# EAGLE design Communication Board Rev A (EAGLE 9.1.2)
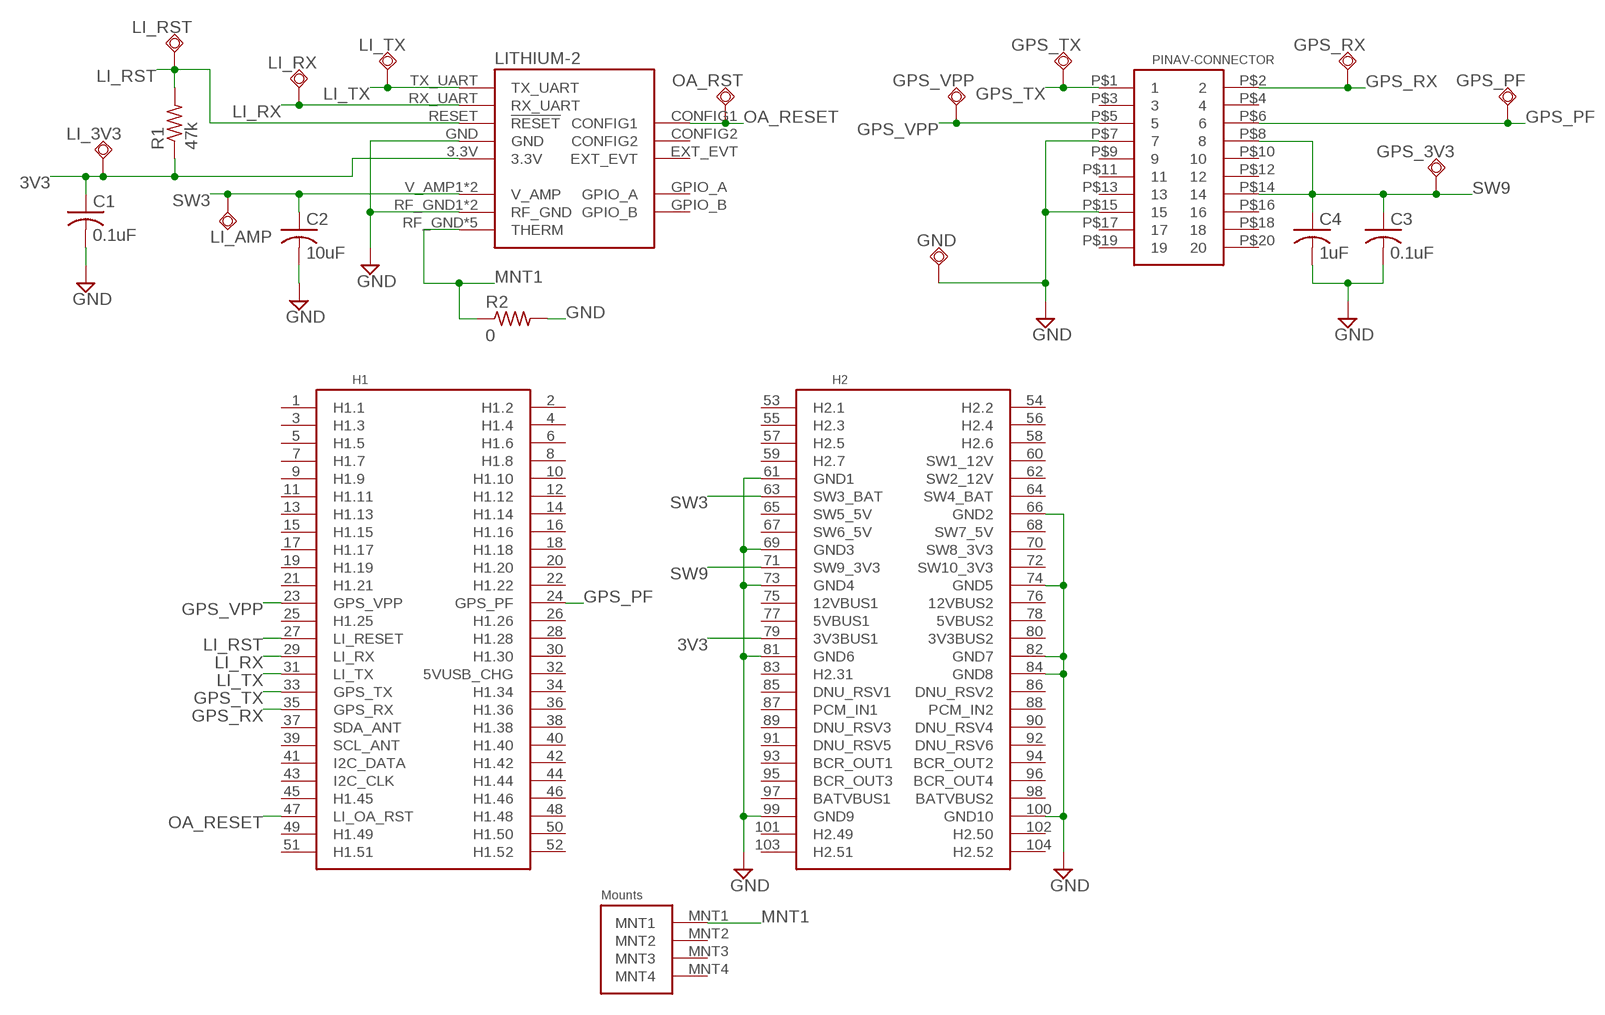
[diagram p0: schematic, sheet 1]

## Parts
C1  0.1uF  C-USC0805  [C0805]
C2  10uF  C-USC0805  [C0805]
C3  0.1uF  C-USC0805  [C0805]
C4  1uF  C-USC0805  [C0805]
GND  TPSQTP10SQ  [TP10SQ]
GPS_3V3  TPSQTP10SQ  [TP10SQ]
GPS_PF  TPSQTP10SQ  [TP10SQ]
GPS_RX  TPSQTP10SQ  [TP10SQ]
GPS_TX  TPSQTP10SQ  [TP10SQ]
GPS_VPP  TPSQTP10SQ  [TP10SQ]
LI_3V3  TPSQTP10SQ  [TP10SQ]
LI_AMP  TPSQTP10SQ  [TP10SQ]
LI_RST  TPSQTP10SQ  [TP10SQ]
LI_RX  TPSQTP10SQ  [TP10SQ]
LI_TX  TPSQTP10SQ  [TP10SQ]
LITHIUM-2  LI-2  [LI-2]
OA_RST  TPSQTP10SQ  [TP10SQ]
PINAV-CONNECTOR  HLE-110-02-X-DVHLE-110-X-DV-PE-BA  [HLE-110-02-X-DV-PE-BE]
R1  47k  R-US_R0805  [R0805]
R2  0  R-US_R0805  [R0805]
U$1  PC104_NO_DIMENSION  [PC104_NO_DIMENSION]

## Nets
3V3: C1.1 LI_3V3.TP LITHIUM-2.3.3V R1.1 U$1.79(3V3BUS1)
GND: C1.2 C2.2 C3.2 C4.2 GND.TP LITHIUM-2.GND LITHIUM-2.RF_GND1(RF_GND) LITHIUM-2.RF_GND2(RF_GND) PINAV-CONNECTOR.P$7 PINAV-CONNECTOR.P$15 R2.2 U$1.61(GND1) U$1.66(GND2) U$1.69(GND3) U$1.73(GND4) U$1.74(GND5) U$1.81(GND6) U$1.82(GND7) U$1.84(GND8) U$1.99(GND9) U$1.100(GND10)
GPS_PF: GPS_PF.TP PINAV-CONNECTOR.P$6 U$1.24(GPS_PF)
GPS_RX: GPS_RX.TP PINAV-CONNECTOR.P$2 U$1.35(GPS_RX)
GPS_TX: GPS_TX.TP PINAV-CONNECTOR.P$1 U$1.33(GPS_TX)
GPS_VPP: GPS_VPP.TP PINAV-CONNECTOR.P$5 U$1.23(GPS_VPP)
LI_RST: LI_RST.TP LITHIUM-2.RESET(!RESET) R1.2 U$1.27(LI_RESET)
LI_RX: LI_RX.TP LITHIUM-2.RX_UART U$1.29(LI_RX)
LI_TX: LI_TX.TP LITHIUM-2.TX_UART U$1.31(LI_TX)
MNT1: LITHIUM-2.RF_GND(THERM) LITHIUM-2.THERM1(THERM) LITHIUM-2.THERM2(THERM) LITHIUM-2.THERM3(THERM) LITHIUM-2.THERM4(THERM) R2.1 U$1.MNT1
OA_RESET: LITHIUM-2.CONFIG1 OA_RST.TP U$1.47(LI_OA_RST)
SW3: C2.1 LI_AMP.TP LITHIUM-2.V_AMP1(V_AMP) LITHIUM-2.V_AMP2(V_AMP) U$1.63(SW3_BAT)
SW9: C3.1 C4.1 GPS_3V3.TP PINAV-CONNECTOR.P$8 PINAV-CONNECTOR.P$14 U$1.71(SW9_3V3)
Unconnected: LITHIUM-2.CONFIG2 LITHIUM-2.EXT_EVT LITHIUM-2.GPIO_A LITHIUM-2.GPIO_B PINAV-CONNECTOR.P$3 PINAV-CONNECTOR.P$4 PINAV-CONNECTOR.P$9 PINAV-CONNECTOR.P$10 PINAV-CONNECTOR.P$11 PINAV-CONNECTOR.P$12 PINAV-CONNECTOR.P$13 PINAV-CONNECTOR.P$16 PINAV-CONNECTOR.P$17 PINAV-CONNECTOR.P$18 PINAV-CONNECTOR.P$19 PINAV-CONNECTOR.P$20 U$1.1(H1.1) U$1.2(H1.2) U$1.3(H1.3) U$1.4(H1.4) U$1.5(H1.5) U$1.6(H1.6) U$1.7(H1.7) U$1.8(H1.8) U$1.9(H1.9) U$1.10(H1.10) U$1.11(H1.11) U$1.12(H1.12) U$1.13(H1.13) U$1.14(H1.14) U$1.15(H1.15) U$1.16(H1.16) U$1.17(H1.17) U$1.18(H1.18) U$1.19(H1.19) U$1.20(H1.20) U$1.21(H1.21) U$1.22(H1.22) U$1.25(H1.25) U$1.26(H1.26) U$1.28(H1.28) U$1.30(H1.30) U$1.32(5VUSB_CHG) U$1.34(H1.34) U$1.36(H1.36) U$1.37(SDA_ANT) U$1.38(H1.38) U$1.39(SCL_ANT) U$1.40(H1.40) U$1.41(I2C_DATA) U$1.42(H1.42) U$1.43(I2C_CLK) U$1.44(H1.44) U$1.45(H1.45) U$1.46(H1.46) U$1.48(H1.48) U$1.49(H1.49) U$1.50(H1.50) U$1.51(H1.51) U$1.52(H1.52) U$1.53(H2.1) U$1.54(H2.2) U$1.55(H2.3) U$1.56(H2.4) U$1.57(H2.5) U$1.58(H2.6) U$1.59(H2.7) U$1.60(SW1_12V) U$1.62(SW2_12V) U$1.64(SW4_BAT) U$1.65(SW5_5V) U$1.67(SW6_5V) U$1.68(SW7_5V) U$1.70(SW8_3V3) U$1.72(SW10_3V3) U$1.75(12VBUS1) U$1.76(12VBUS2) U$1.77(5VBUS1) U$1.78(5VBUS2) U$1.80(3V3BUS2) U$1.83(H2.31) U$1.85(DNU_RSV1) U$1.86(DNU_RSV2) U$1.87(PCM_IN1) U$1.88(PCM_IN2) U$1.89(DNU_RSV3) U$1.90(DNU_RSV4) U$1.91(DNU_RSV5) U$1.92(DNU_RSV6) U$1.93(BCR_OUT1) U$1.94(BCR_OUT2) U$1.95(BCR_OUT3) U$1.96(BCR_OUT4) U$1.97(BATVBUS1) U$1.98(BATVBUS2) U$1.101(H2.49) U$1.102(H2.50) U$1.103(H2.51) U$1.104(H2.52) U$1.MNT2 U$1.MNT3 U$1.MNT4

## Library data of the parts
C1-C4 = resistor:C-US: CAPACITOR, American symbol
GND GPS_3V3 GPS_PF GPS_RX GPS_TX GPS_VPP LI_3V3 LI_AMP LI_RST LI_RX LI_TX OA_RST = testpad:TPSQ: Test pad
LITHIUM-2 = Cubesat:LI-2
PINAV-CONNECTOR = HLE-110-02-X-DV:HLE-110-02-X-DV
R1 R2 = resistor:R-US_: RESISTOR, American symbol
U$1 = Cubesat:PC104_NO_DIMENSION

## Board
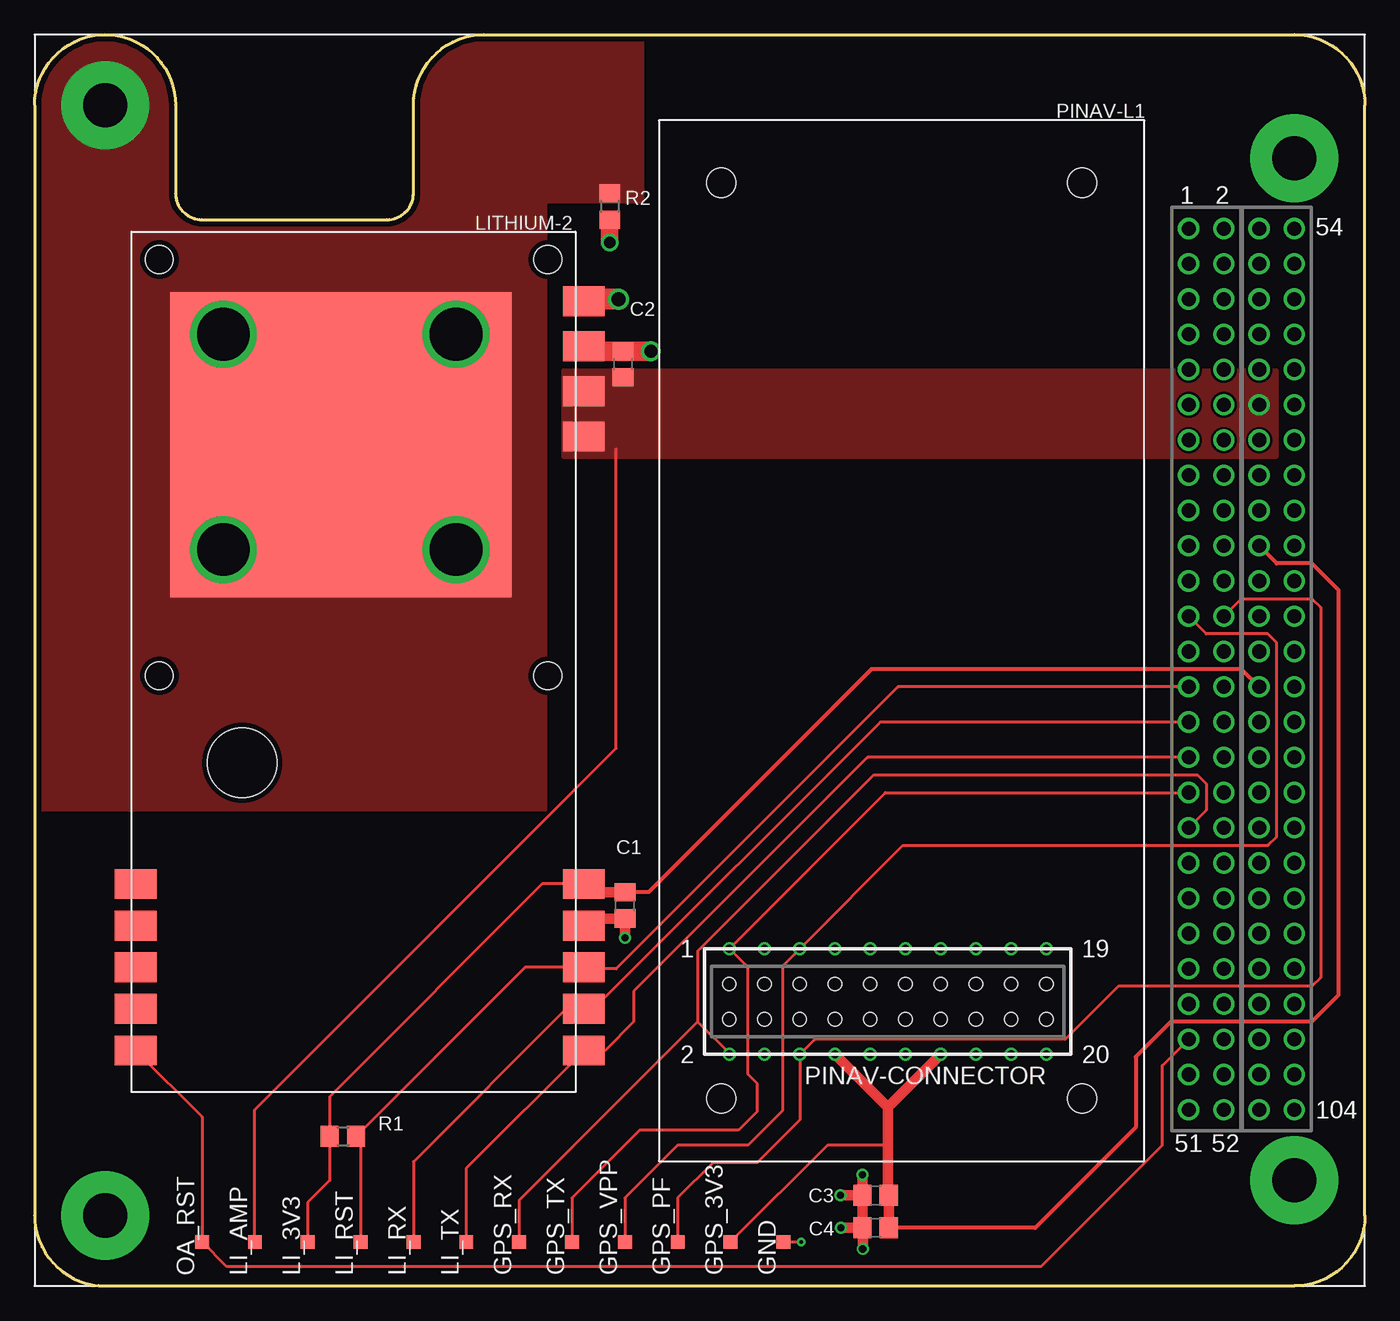
[diagram p1: board, top side]
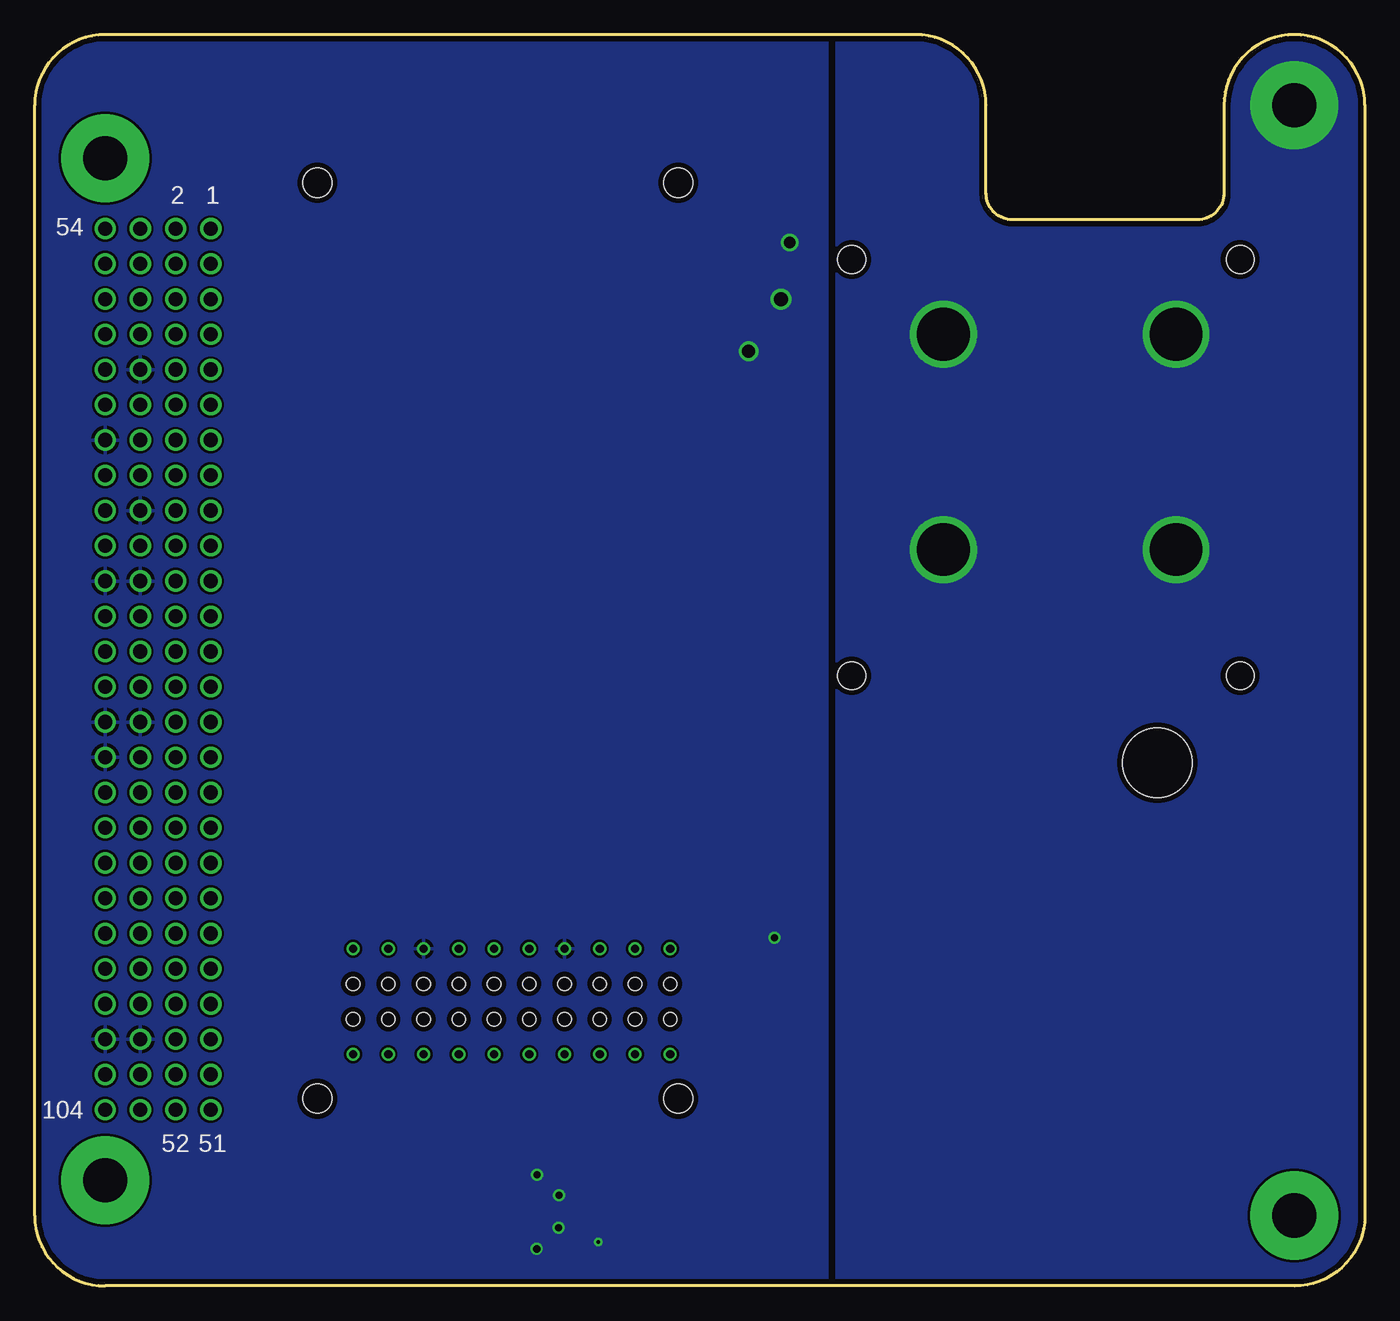
[diagram p2: board, bottom side, seen from below]

Size 95.89 x 90.17 mm. Coordinates in mm from the lower left corner, seen from the top.
Outline: 0,85.09 arc-90 5.08,90.17 arc-90 10.16,85.09 10.16,78.74 arc90 12.06,76.83 25.4,76.83 arc90 27.3,78.74 27.3,85.09 arc-90 32.38,90.17 90.81,90.17 arc-90 95.89,85.09 95.89,5.08 arc-90 90.81,0 5.08,0 arc-90 0,5.08 0,85.09
Copper layers (1*16): Top 0.035559375mm / dielectric 1.501140625mm / Bottom 0.035559375mm
Design rules "typical_4pcb": minimum track width 7mil, minimum drill 5mil, track to track 7mil, track to pad 7mil, pad to pad 7mil, via to via 7mil, smd to smd 7mil, copper to edge 15mil, drill to drill 8mil, minimum pad ring 7mil, minimum via ring 7mil, stop-mask expansion 4mil, vias tented up to drill 0mil, thermal gap 10mil

### Footprints (pad centres in the part's own frame; a part is rotated, then mirrored left to right if it is on the bottom)
C0805 = smd 1.3 x 1.5: 1 -0.95,0; 2 0.95,0
TP10SQ = smd 1 x 1: TP 0,0
LI-2 = smd 3 x 2.15: 3.3V 32.6,15; CONFIG1 0.3,3; CONFIG2 0.3,6; EXT_EVT 0.3,9; GND 32.6,12; GPIO_A 0.3,12; GPIO_B 0.3,15; RESET 32.6,9; RF_GND1 32.6,53.75; RF_GND2 32.6,57; RX_UART 32.6,6; TX_UART 32.6,3; V_AMP1 32.6,47.25; V_AMP2 32.6,50.5 | smd 24.6 x 21.98: RF_GND 15.08,46.66 | drill 3.81: THERM1 6.62,54.61; THERM2 23.4,54.61; THERM3 23.4,39.1; THERM4 6.62,39.1 | hole 2: 2,60; 2,30; 30,60; 30,30 | hole 5: 7.97,23.73
HLE-110-02-X-DV-PE-BE = drill 0.584: P$1 11.43,-3.81; P$2 11.43,3.81; P$3 8.89,-3.81; P$4 8.89,3.81; P$5 6.35,-3.81; P$6 6.35,3.81; P$7 3.81,-3.81; P$8 3.81,3.81; P$9 1.27,-3.81; P$10 1.27,3.81; P$11 -1.27,-3.81; P$12 -1.27,3.81; P$13 -3.81,-3.81; P$14 -3.81,3.81; P$15 -6.35,-3.81; P$16 -6.35,3.81; P$17 -8.89,-3.81; P$18 -8.89,3.81; P$19 -11.43,-3.81; P$20 -11.43,3.81
PINAV-L1 = hole 2.1: 30.5,4.5; 30.5,70.5; 4.5,4.5; 4.5,70.5 | hole 0.965: 7.07,64.77; 9.61,64.77; 12.15,64.77; 14.69,64.77; 17.23,64.77; 19.77,64.77; 22.31,64.77; 24.85,64.77; 27.39,64.77; 29.93,64.77; 29.93,62.23; 27.39,62.23; 24.85,62.23; 22.31,62.23; 19.77,62.23; 17.23,62.23; 14.69,62.23; 12.15,62.23; 9.61,62.23; 7.07,62.23
R0805 = smd 1.3 x 1.5: 1 -0.95,0; 2 0.95,0
PC104_NO_DIMENSION = drill 1.016 pad 1.524: 1 83.185,76.2; 2 85.725,76.2; 3 83.185,73.66; 4 85.725,73.66; 5 83.185,71.12; 6 85.725,71.12; 7 83.185,68.58; 8 85.725,68.58; 9 83.185,66.04; 10 85.725,66.04; 11 83.185,63.5; 12 85.725,63.5; 13 83.185,60.96; 14 85.725,60.96; 15 83.185,58.42; 16 85.725,58.42; 17 83.185,55.88; 18 85.725,55.88; 19 83.185,53.34; 20 85.725,53.34; 21 83.185,50.8; 22 85.725,50.8; 23 83.185,48.26; 24 85.725,48.26; 25 83.185,45.72; 26 85.725,45.72; 27 83.185,43.18; 28 85.725,43.18; 29 83.185,40.64; 30 85.725,40.64; 31 83.185,38.1; 32 85.725,38.1; 33 83.185,35.56; 34 85.725,35.56; 35 83.185,33.02; 36 85.725,33.02; 37 83.185,30.48; 38 85.725,30.48; 39 83.185,27.94; 40 85.725,27.94; 41 83.185,25.4; 42 85.725,25.4; 43 83.185,22.86; 44 85.725,22.86; 45 83.185,20.32; 46 85.725,20.32; 47 83.185,17.78; 48 85.725,17.78; 49 83.185,15.24; 50 85.725,15.24; 51 83.185,12.7; 52 85.725,12.7; 53 88.265,76.2; 54 90.805,76.2; 55 88.265,73.66; 56 90.805,73.66; 57 88.265,71.12; 58 90.805,71.12; 59 88.265,68.58; 60 90.805,68.58; 61 88.265,66.04; 62 90.805,66.04; 63 88.265,63.5; 64 90.805,63.5; 65 88.265,60.96; 66 90.805,60.96; 67 88.265,58.42; 68 90.805,58.42; 69 88.265,55.88; 70 90.805,55.88; 71 88.265,53.34; 72 90.805,53.34; 73 88.265,50.8; 74 90.805,50.8; 75 88.265,48.26; 76 90.805,48.26; 77 88.265,45.72; 78 90.805,45.72; 79 88.265,43.18; 80 90.805,43.18; 81 88.265,40.64; 82 90.805,40.64; 83 88.265,38.1; 84 90.805,38.1; 85 88.265,35.56; 86 90.805,35.56; 87 88.265,33.02; 88 90.805,33.02; 89 88.265,30.48; 90 90.805,30.48; 91 88.265,27.94; 92 90.805,27.94; 93 88.265,25.4; 94 90.805,25.4; 95 88.265,22.86; 96 90.805,22.86; 97 88.265,20.32; 98 90.805,20.32; 99 88.265,17.78; 100 90.805,17.78; 101 88.265,15.24; 102 90.805,15.24; 103 88.265,12.7; 104 90.805,12.7 | drill 3.175 pad 6.35: MNT1 5.08,85.09; MNT2 5.08,5.08; MNT3 90.805,81.28; MNT4 90.805,7.62

### Placement (x,y rotation side)
C1  42.55,27.43 270 top
C2  42.42,66.42 90 top
C3  60.61,6.53 180 top
C4  60.61,4.19 180 top
GND  53.98,3.17 90 top
GPS_3V3  50.16,3.17 90 top
GPS_PF  46.35,3.17 90 top
GPS_RX  34.92,3.17 90 top
GPS_TX  38.73,3.17 90 top
GPS_VPP  42.55,3.17 90 top
LI_3V3  19.68,3.17 90 top
LI_AMP  15.88,3.17 90 top
LI_RST  23.5,3.17 90 top
LI_RX  27.3,3.17 90 top
LI_TX  31.11,3.17 90 top
LITHIUM-2  6.99,13.97 0 top
OA_RST  12.06,3.17 90 top
PINAV-CONNECTOR  61.5,20.5 180 top
PINAV-L1  [PINAV-L1]  80,84 180 top
R1  22.23,10.79 0 top
R2  41.45,77.8 270 top
U$1  0,0 0 top

### Tracks (layer width: path | path; a pad name or v marks a point on that pad's centre or on a via)
3V3
  Top 0.203: LITHIUM-2.3.3V 36.59,28.97 21.27,13.65 R1.1 21.27,7.62 19.68,6.03 LI_3V3.TP
  Top 0.305: U$1.79 87,44.45 60.33,44.45 44.26,28.38 C1.1
  Top 0.762: C1.1 40.17,28.38 LITHIUM-2.3.3V
GND  (via drill 0.25, 0.51, 0.84, 0.94, 1.02)
  Top 0.203: GND.TP v55.24,3.17
  Top 0.762: C4.2 C3.2 | C3.2 v58.09,6.53 | C4.2 v58.12,4.19 | C3.2 v59.66,8.03 | C4.2 59.69,4.16 v59.69,2.67 | LITHIUM-2.GND 40.1,26.48 C1.2 v42.55,25.09
  Top 1.27: R2.2 v41.45,75.18
  Top 1.397: LITHIUM-2.RF_GND1 39.59,67.37 C2.2 v44.41,67.37 v44.42,67.36
  Top 1.524: v42.09,71.09 39.71,71.09 LITHIUM-2.RF_GND2
  pour Bottom (rank 2): 38.73,90.17 95.89,90.17 95.89,0 38.73,0
GPS_PF
  Top 0.203: U$1.24 87,49.53 92.08,49.53 92.71,48.9 92.71,22.23 92.08,21.59 78.11,21.59 74.3,17.78 56.24,17.78 PINAV-CONNECTOR.P$6 55.15,11.97 52.07,8.89 48.9,8.89 46.35,6.35 GPS_PF.TP
GPS_RX
  Top 0.203: 47.79,19.05 47.79,24.13 60.49,36.83 83.82,36.83 84.45,36.2 84.45,34.29 U$1.35 | 47.79,19.05 50.07,16.77 PINAV-CONNECTOR.P$2 | 47.79,19.05 34.92,6.19 GPS_RX.TP
GPS_TX
  Top 0.203: U$1.33 61.32,35.56 PINAV-CONNECTOR.P$1 51.38,23 51.38,15.29 52.07,14.61 52.07,12.57 50.72,11.23 43.61,11.23 38.73,6.35 GPS_TX.TP
GPS_VPP
  Top 0.203: U$1.23 84.45,46.99 88.9,46.99 89.53,46.35 89.53,32.38 88.9,31.75 62.59,31.75 PINAV-CONNECTOR.P$5 53.9,23.06 53.9,12.62 51.44,10.16 46.35,10.16 42.55,6.35 GPS_VPP.TP
LI_RST
  Top 0.203: LITHIUM-2.RESET 39.37,22.97 | 39.37,22.97 39.48,22.86 41.91,22.86 62.23,43.18 U$1.27 | LI_RST.TP 23.5,10.47 R1.2 35.35,22.97 39.37,22.97
LI_RX
  Top 0.203: U$1.29 60.96,40.64 40.29,19.97 LITHIUM-2.RX_UART 38.31,19.97 27.3,8.96 LI_RX.TP
LI_TX
  Top 0.203: U$1.31 60.05,38.1 43.18,21.23 43.18,19.05 41.1,16.97 LITHIUM-2.TX_UART 31.11,8.5 31.11,5.96 LI_TX.TP
MNT1
  pour Top (no thermals): 0,90.17 10.16,90.17 43.81,90.17 43.81,78.11 36.83,78.11 36.83,34.29 0,34.29
  pour Bottom (no thermals): 0,90.17 10.16,90.17 38.1,90.17 38.1,76.2 38.1,0 0,0
OA_RESET
  Top 0.203: U$1.47 81.28,15.88 81.28,10.16 72.52,1.4 13.84,1.4 OA_RST.TP 12.06,12.19 LITHIUM-2.CONFIG1
SW3
  Top 0.203: LI_AMP.TP 15.88,12.7 41.91,38.73 41.91,60.33
  pour Top (no thermals): 89.53,65.02 89.53,61.98 89.53,59.69 38.1,59.69 38.1,66.04 89.53,66.04
SW9
  Top 0.203: 61.5,6.59 C3.1 | GPS_3V3.TP 57.15,10.16 61.5,10.16
  Top 0.305: C4.1 72.14,4.19 79.38,11.43 79.38,16.51 81.92,19.05 92.08,19.05 93.98,20.95 93.98,50.16 92.08,52.07 89.53,52.07 U$1.71
  Top 0.762: PINAV-CONNECTOR.P$8 61.5,12.88 | PINAV-CONNECTOR.P$14 61.5,12.88 | 61.5,12.88 61.5,10.16 61.5,6.59 | C3.1 C4.1

### Text on the board
Document: VT VCC Communication Board / Rev A - 8/03/18